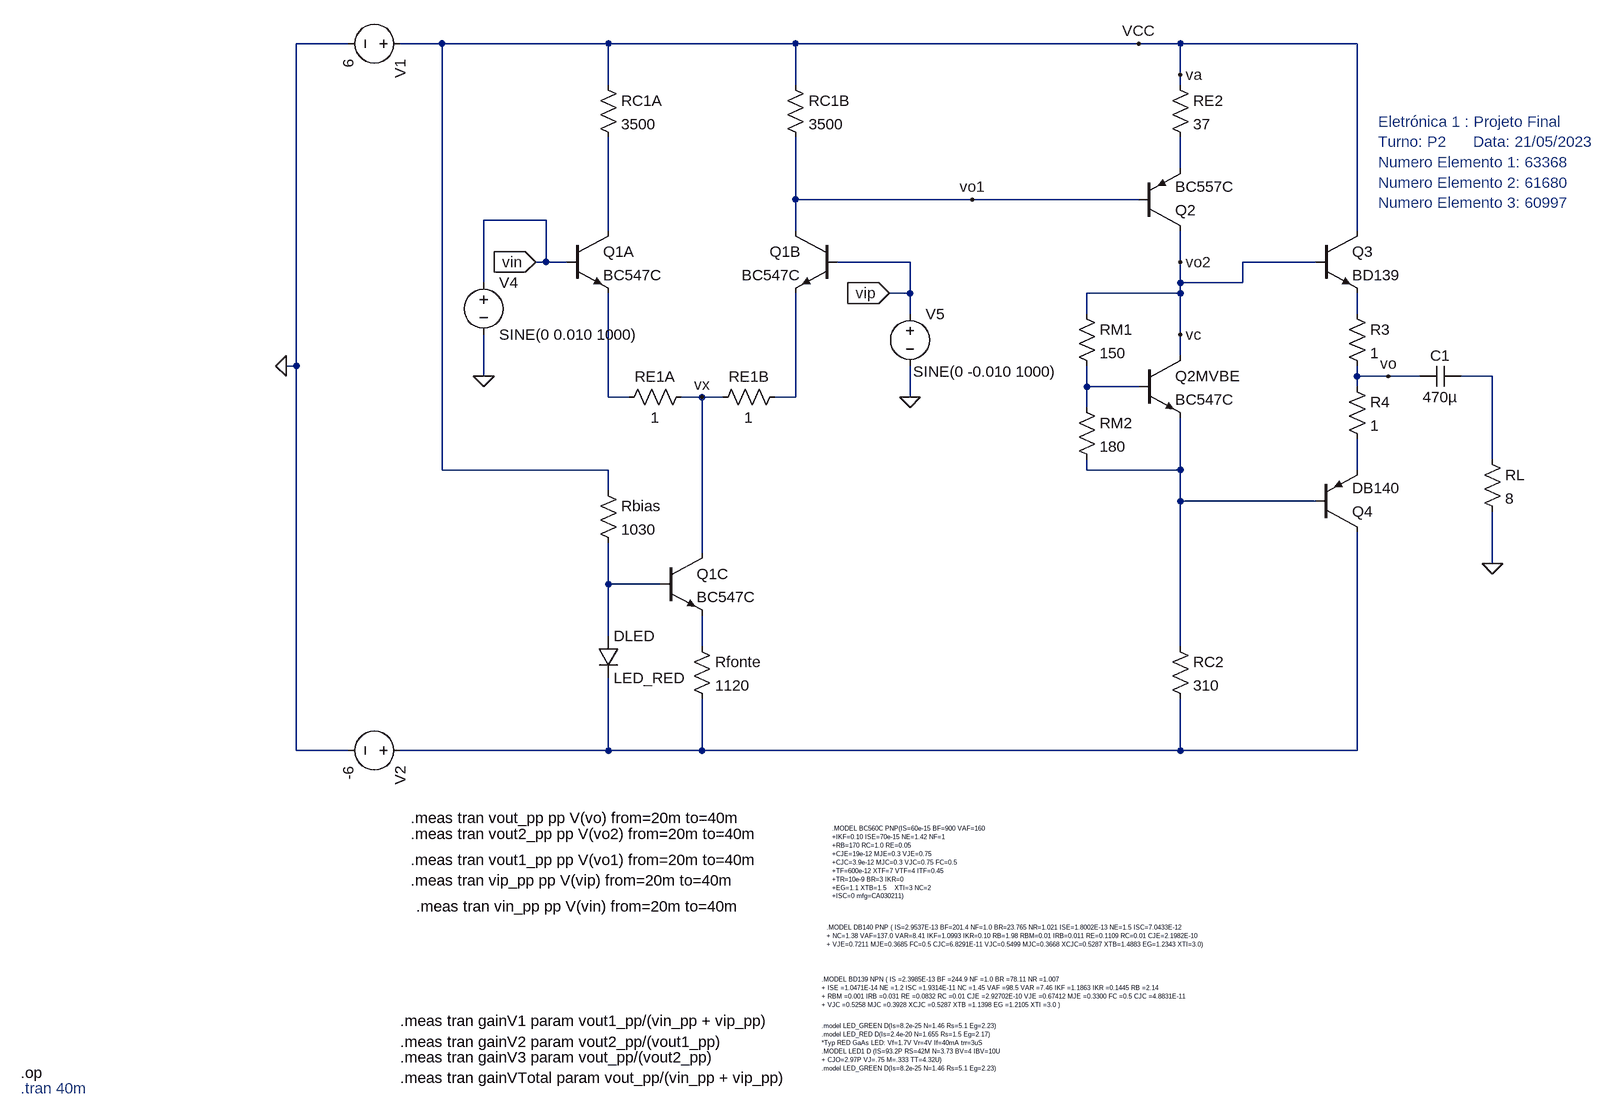
[diagram p0: schematic Eletronics_I_final_OPAMP_schematic.asc]
Eletronics_I_final_OPAMP_schematic.asc, the LTspice schematic file:
Version 4
SHEET 1 1956 1000
WIRE -816 -624 -896 -624
WIRE -672 -624 -736 -624
WIRE -416 -624 -672 -624
WIRE -128 -624 -416 -624
WIRE 400 -624 -128 -624
WIRE 464 -624 400 -624
WIRE 736 -624 464 -624
WIRE 464 -576 464 -624
WIRE -416 -560 -416 -624
WIRE -128 -560 -128 -624
WIRE 464 -560 464 -576
WIRE 464 -432 464 -480
WIRE -128 -384 -128 -480
WIRE 144 -384 -128 -384
WIRE 400 -384 144 -384
WIRE -512 -352 -608 -352
WIRE -416 -336 -416 -480
WIRE -128 -336 -128 -384
WIRE 736 -336 736 -624
WIRE -512 -288 -512 -352
WIRE -512 -288 -528 -288
WIRE -480 -288 -512 -288
WIRE 48 -288 -64 -288
WIRE 464 -288 464 -336
WIRE 672 -288 560 -288
WIRE -608 -256 -608 -352
WIRE 464 -256 464 -288
WIRE 560 -256 560 -288
WIRE 560 -256 464 -256
WIRE 48 -240 48 -288
WIRE 48 -240 16 -240
WIRE 464 -240 464 -256
WIRE 464 -240 320 -240
WIRE 48 -208 48 -240
WIRE 320 -208 320 -240
WIRE 736 -208 736 -240
WIRE 464 -176 464 -240
WIRE 464 -144 464 -176
WIRE -896 -128 -896 -624
WIRE -896 -128 -912 -128
WIRE -608 -112 -608 -176
WIRE 736 -112 736 -128
WIRE 784 -112 736 -112
WIRE 832 -112 784 -112
WIRE 944 -112 896 -112
WIRE 320 -96 320 -128
WIRE 400 -96 320 -96
WIRE 736 -96 736 -112
WIRE -416 -80 -416 -240
WIRE -384 -80 -416 -80
WIRE -272 -80 -304 -80
WIRE -240 -80 -272 -80
WIRE -128 -80 -128 -240
WIRE -128 -80 -160 -80
WIRE 48 -80 48 -128
WIRE 320 -64 320 -96
WIRE 944 16 944 -112
WIRE -672 32 -672 -624
WIRE -416 32 -672 32
WIRE 320 32 320 16
WIRE 464 32 464 -48
WIRE 464 32 320 32
WIRE 736 32 736 -16
WIRE -416 64 -416 32
WIRE 464 80 464 32
WIRE 672 80 464 80
WIRE -272 160 -272 -80
WIRE 944 176 944 96
WIRE -416 208 -416 144
WIRE -336 208 -416 208
WIRE -416 288 -416 208
WIRE -272 304 -272 256
WIRE 464 304 464 80
WIRE -896 464 -896 -128
WIRE -816 464 -896 464
WIRE -416 464 -416 352
WIRE -416 464 -736 464
WIRE -272 464 -272 384
WIRE -272 464 -416 464
WIRE 464 464 464 384
WIRE 464 464 -272 464
WIRE 736 464 736 128
WIRE 736 464 464 464
FLAG -912 -128 0
FLAG 400 -624 VCC
FLAG -272 -80 vx
FLAG -528 -288 vin
IOPIN -528 -288 In
FLAG 16 -240 vip
IOPIN 16 -240 In
FLAG 944 176 0
FLAG 144 -384 vo1
FLAG 464 -288 vo2
FLAG 48 -80 0
FLAG -608 -112 0
FLAG 784 -112 vo
FLAG 464 -576 va
FLAG 464 -176 vc
DATAFLAG 480 80 ""
DATAFLAG 480 -256 ""
DATAFLAG 224 -384 ""
SYMBOL npn 672 -336 R0
SYMATTR InstName Q3
SYMATTR Value BD139
SYMBOL pnp 672 128 M180
SYMATTR InstName Q4
SYMATTR Value DB140
SYMBOL Res 720 -224 R0
SYMATTR InstName R3
SYMATTR Value 1
SYMBOL Res 720 -112 R0
SYMATTR InstName R4
SYMATTR Value 1
SYMBOL Cap 832 -96 R270
WINDOW 0 32 32 VTop 2
WINDOW 3 0 32 VBottom 2
SYMATTR InstName C1
SYMATTR Value 470µ
SYMBOL pnp 400 -336 M180
SYMATTR InstName Q2
SYMATTR Value BC557C
SYMBOL voltage -720 -624 R90
WINDOW 123 0 0 Left 0
WINDOW 39 0 0 Left 0
SYMATTR InstName V1
SYMATTR Value 6
SYMBOL voltage -720 464 R90
WINDOW 123 0 0 Left 0
WINDOW 39 0 0 Left 0
SYMATTR InstName V2
SYMATTR Value -6
SYMBOL Res 448 -576 R0
SYMATTR InstName RE2
SYMATTR Value 37
SYMBOL Res 448 288 R0
SYMATTR InstName RC2
SYMATTR Value 310
SYMBOL npn -480 -336 R0
SYMATTR InstName Q1A
SYMATTR Value BC547C
SYMBOL npn -64 -336 M0
SYMATTR InstName Q1B
SYMATTR Value BC547C
SYMBOL res -144 -576 R0
SYMATTR InstName RC1B
SYMATTR Value 3500
SYMBOL res -432 -576 R0
SYMATTR InstName RC1A
SYMATTR Value 3500
SYMBOL res -288 -96 R90
WINDOW 0 0 56 VBottom 2
WINDOW 3 32 56 VTop 2
SYMATTR InstName RE1A
SYMATTR Value 1
SYMBOL res -144 -96 R90
WINDOW 0 0 56 VBottom 2
WINDOW 3 32 56 VTop 2
SYMATTR InstName RE1B
SYMATTR Value 1
SYMBOL res 928 0 R0
SYMATTR InstName RL
SYMATTR Value 8
SYMBOL voltage -608 -272 R0
WINDOW 123 0 0 Left 0
WINDOW 39 0 0 Left 0
SYMATTR InstName V4
SYMATTR Value SINE(0 0.010 1000)
SYMBOL voltage 48 -224 R0
WINDOW 123 0 0 Left 0
WINDOW 39 0 0 Left 0
WINDOW 3 5 105 Left 2
SYMATTR Value SINE(0 -0.010 1000)
SYMATTR InstName V5
SYMBOL npn -336 160 R0
SYMATTR InstName Q1C
SYMATTR Value BC547C
SYMBOL res -288 288 R0
SYMATTR InstName Rfonte
SYMATTR Value 1120
SYMBOL res -432 48 R0
SYMATTR InstName Rbias
SYMATTR Value 1030
SYMBOL diode -432 288 R0
SYMATTR InstName DLED
SYMATTR Value LED_RED
SYMBOL npn 400 -144 R0
SYMATTR InstName Q2MVBE
SYMATTR Value BC547C
SYMBOL res 304 -224 R0
SYMATTR InstName RM1
SYMATTR Value 150
SYMBOL res 304 -80 R0
SYMATTR InstName RM2
SYMATTR Value 180
TEXT -72 584 Left 0 !.MODEL BC560C PNP(IS=60e-15 BF=900 VAF=160\n+IKF=0.10 ISE=70e-15 NE=1.42 NF=1\n+RB=170 RC=1.0 RE=0.05\n+CJE=19e-12 MJE=0.3 VJE=0.75\n+CJC=3.9e-12 MJC=0.3 VJC=0.75 FC=0.5\n+TF=600e-12 XTF=7 VTF=4 ITF=0.45\n+TR=10e-9 BR=3 IKR=0\n+EG=1.1 XTB=1.5	XTI=3 NC=2\n+ISC=0 mfg=CA030211)
TEXT -80 736 Left 0 !.MODEL DB140 PNP ( IS=2.9537E-13 BF=201.4 NF=1.0 BR=23.765 NR=1.021 ISE=1.8002E-13 NE=1.5 ISC=7.0433E-12\n+ NC=1.38 VAF=137.0 VAR=8.41 IKF=1.0993 IKR=0.10 RB=1.98 RBM=0.01 IRB=0.011 RE=0.1109 RC=0.01 CJE=2.1982E-10\n+ VJE=0.7211 MJE=0.3685 FC=0.5 CJC=6.8291E-11 VJC=0.5499 MJC=0.3668 XCJC=0.5287 XTB=1.4883 EG=1.2343 XTI=3.0)
TEXT -88 816 Left 0 !.MODEL BD139 NPN ( IS =2.3985E-13 BF =244.9 NF =1.0 BR =78.11 NR =1.007\n+ ISE =1.0471E-14 NE =1.2 ISC =1.9314E-11 NC =1.45 VAF =98.5 VAR =7.46 IKF =1.1863 IKR =0.1445 RB =2.14\n+ RBM =0.001 IRB =0.031 RE =0.0832 RC =0.01 CJE =2.92702E-10 VJE =0.67412 MJE =0.3300 FC =0.5 CJC =4.8831E-11\n+ VJC =0.5258 MJC =0.3928 XCJC =0.5287 XTB =1.1398 EG =1.2105 XTI =3.0 )
TEXT 768 -504 Left 2 ;Eletrónica 1 : Projeto Final\nTurno: P2      Data: 21/05/2023\nNumero Elemento 1: 63368\nNumero Elemento 2: 61680\nNumero Elemento 3: 60997
TEXT -88 888 Left 0 !.model LED_GREEN D(Is=8.2e-25 N=1.46 Rs=5.1 Eg=2.23)\n.model LED_RED D(Is=2.4e-20 N=1.655 Rs=1.5 Eg=2.17)\n*Typ RED GaAs LED: Vf=1.7V Vr=4V If=40mA trr=3uS\n.MODEL LED1 D (IS=93.2P RS=42M N=3.73 BV=4 IBV=10U\n+ CJO=2.97P VJ=.75 M=.333 TT=4.32U)\n.model LED_GREEN D(Is=8.2e-25 N=1.46 Rs=5.1 Eg=2.23)
TEXT -1320 960 Left 2 !.op
TEXT -1320 984 Left 2 ;.tran 40m
TEXT -712 704 Left 2 !.meas tran vin_pp pp V(vin) from=20m to=40m
TEXT -736 880 Left 2 !.meas tran gainV1 param vout1_pp/(vin_pp + vip_pp)
TEXT -720 664 Left 2 !.meas tran vip_pp pp V(vip) from=20m to=40m
TEXT -720 592 Left 2 !.meas tran vout2_pp pp V(vo2) from=20m to=40m
TEXT -720 568 Left 2 !.meas tran vout_pp pp V(vo) from=20m to=40m
TEXT -736 912 Left 2 !.meas tran gainV2 param vout2_pp/(vout1_pp)
TEXT -736 968 Left 2 !.meas tran gainVTotal param vout_pp/(vin_pp + vip_pp)
TEXT -736 936 Left 2 !.meas tran gainV3 param vout_pp/(vout2_pp)
TEXT -720 632 Left 2 !.meas tran vout1_pp pp V(vo1) from=20m to=40m

The netlist it stands for:
* Eletronics_I_final_OPAMP_schematic.asc
Q3 va vc N003 0 BD139
Q4 N012 N008 N009 0 DB140
R3 N003 vo 1
R4 vo N009 1
C1 vo N004 470µ
Q2 vc vo1 N001 0 BC557C
V1 va 0 6
V2 N012 0 -6
RE2 va N001 37
RC2 N008 N012 310
Q1A N002 vin N006 0 BC547C
Q1B vo1 vip N007 0 BC547C
RC1B va vo1 3500
RC1A va N002 3500
RE1A vx N006 1
RE1B N007 vx 1
RL N004 0 8
V4 vin 0 SINE(0 0.010 1000)
V5 vip 0 SINE(0 -0.010 1000)
Q1C vx N010 N011 0 BC547C
Rfonte N011 N012 1120
Rbias va N010 1030
DLED N010 N012 LED_RED
Q2MVBE vc N005 N008 0 BC547C
RM1 vc N005 150
RM2 N005 N008 180
.model D D
.lib standard.dio
.model NPN NPN
.model PNP PNP
.lib standard.bjt
.MODEL BC560C PNP(IS=60e-15 BF=900 VAF=160
+IKF=0.10 ISE=70e-15 NE=1.42 NF=1
+RB=170 RC=1.0 RE=0.05
+CJE=19e-12 MJE=0.3 VJE=0.75
+CJC=3.9e-12 MJC=0.3 VJC=0.75 FC=0.5
+TF=600e-12 XTF=7 VTF=4 ITF=0.45
+TR=10e-9 BR=3 IKR=0
+EG=1.1 XTB=1.5	XTI=3 NC=2
+ISC=0 mfg=CA030211)
.MODEL DB140 PNP ( IS=2.9537E-13 BF=201.4 NF=1.0 BR=23.765 NR=1.021 ISE=1.8002E-13 NE=1.5 ISC=7.0433E-12
+ NC=1.38 VAF=137.0 VAR=8.41 IKF=1.0993 IKR=0.10 RB=1.98 RBM=0.01 IRB=0.011 RE=0.1109 RC=0.01 CJE=2.1982E-10
+ VJE=0.7211 MJE=0.3685 FC=0.5 CJC=6.8291E-11 VJC=0.5499 MJC=0.3668 XCJC=0.5287 XTB=1.4883 EG=1.2343 XTI=3.0)
.MODEL BD139 NPN ( IS =2.3985E-13 BF =244.9 NF =1.0 BR =78.11 NR =1.007
+ ISE =1.0471E-14 NE =1.2 ISC =1.9314E-11 NC =1.45 VAF =98.5 VAR =7.46 IKF =1.1863 IKR =0.1445 RB =2.14
+ RBM =0.001 IRB =0.031 RE =0.0832 RC =0.01 CJE =2.92702E-10 VJE =0.67412 MJE =0.3300 FC =0.5 CJC =4.8831E-11
+ VJC =0.5258 MJC =0.3928 XCJC =0.5287 XTB =1.1398 EG =1.2105 XTI =3.0 )
* Eletrónica 1 : Projeto Final
* Turno: P2      Data: 21/05/2023
* Numero Elemento 1: 63368
* Numero Elemento 2: 61680
* Numero Elemento 3: 60997
.model LED_GREEN D(Is=8.2e-25 N=1.46 Rs=5.1 Eg=2.23)
.model LED_RED D(Is=2.4e-20 N=1.655 Rs=1.5 Eg=2.17)
*Typ RED GaAs LED: Vf=1.7V Vr=4V If=40mA trr=3uS
.MODEL LED1 D (IS=93.2P RS=42M N=3.73 BV=4 IBV=10U
+ CJO=2.97P VJ=.75 M=.333 TT=4.32U)
.model LED_GREEN D(Is=8.2e-25 N=1.46 Rs=5.1 Eg=2.23)
.op
* .tran 40m
.meas tran vin_pp pp V(vin) from=20m to=40m
.meas tran gainV1 param vout1_pp/(vin_pp + vip_pp)
.meas tran vip_pp pp V(vip) from=20m to=40m
.meas tran vout2_pp pp V(vo2) from=20m to=40m
.meas tran vout_pp pp V(vo) from=20m to=40m
.meas tran gainV2 param vout2_pp/(vout1_pp)
.meas tran gainVTotal param vout_pp/(vin_pp + vip_pp)
.meas tran gainV3 param vout_pp/(vout2_pp)
.meas tran vout1_pp pp V(vo1) from=20m to=40m
.backanno
.end